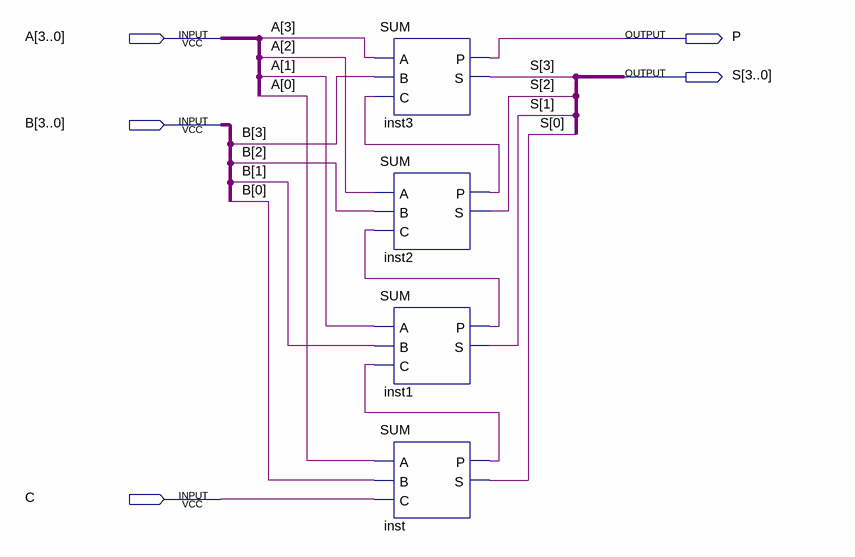
[diagram p0: schematic sheet]
// Quartus schematic SUM_2.bdf as structural Verilog: 4 symbols, 5 pins
module SUM_2 (
  input  [3:0] A,
  input  [3:0] B,
  input  C,
  output P,
  output [3:0] S
);

  wire inst1_p, inst2_p, inst_p;

  SUM inst3 (.A(A[3]), .B(B[3]), .C(inst2_p), .P(P), .S(S[3]));
  SUM inst2 (.A(A[2]), .B(B[2]), .C(inst1_p), .P(inst2_p), .S(S[2]));
  SUM inst1 (.A(A[1]), .B(B[1]), .C(inst_p), .P(inst1_p), .S(S[1]));
  SUM inst (.A(A[0]), .B(B[0]), .C(C), .P(inst_p), .S(S[0]));
endmodule
